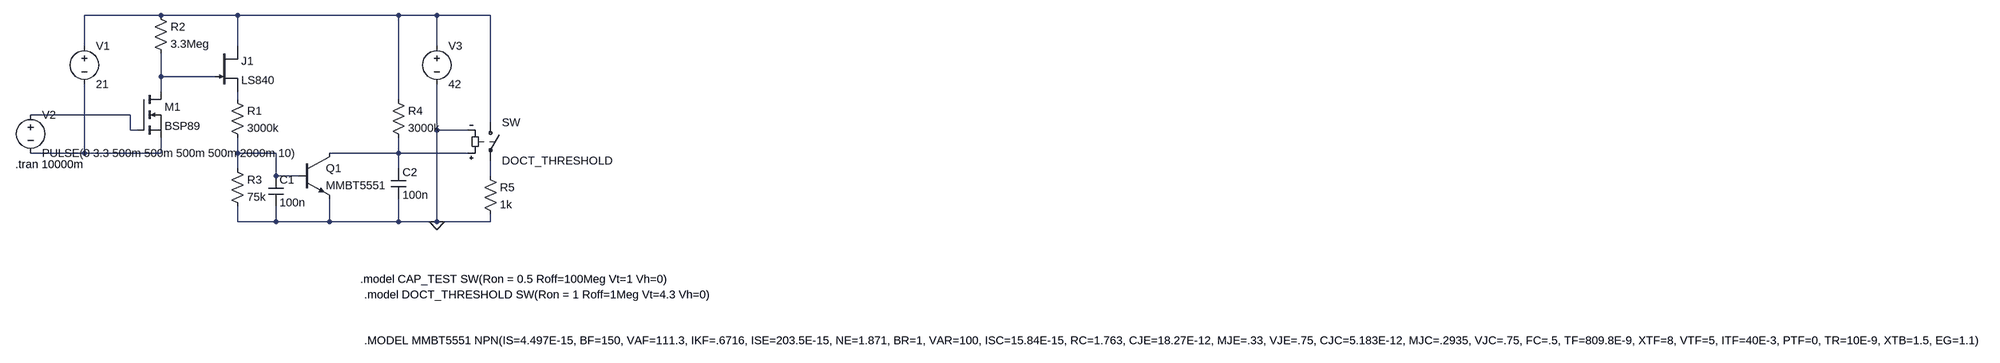
[diagram p0: schematic Reset_circuit.asc]
Reset_circuit.asc, the LTspice schematic file:
Version 4
SHEET 1 4008 2464
WIRE 16 32 -144 32
WIRE 176 32 16 32
WIRE 512 32 176 32
WIRE 592 32 512 32
WIRE 704 32 592 32
WIRE -144 96 -144 32
WIRE 176 96 176 32
WIRE 592 96 592 32
WIRE 16 160 16 112
WIRE 128 160 16 160
WIRE 16 192 16 160
WIRE 176 208 176 192
WIRE 512 208 512 32
WIRE -48 240 -256 240
WIRE 704 256 704 32
WIRE -48 272 -48 240
WIRE -32 272 -48 272
WIRE 592 272 592 176
WIRE 656 272 592 272
WIRE -144 320 -144 176
WIRE -144 320 -256 320
WIRE 16 320 16 288
WIRE 16 320 -144 320
WIRE 176 320 176 288
WIRE 256 320 176 320
WIRE 512 320 512 288
WIRE 512 320 368 320
WIRE 656 320 512 320
WIRE 176 352 176 320
WIRE 512 352 512 320
WIRE 256 368 256 320
WIRE 304 368 256 368
WIRE 704 368 704 336
WIRE 176 464 176 432
WIRE 256 464 256 432
WIRE 256 464 176 464
WIRE 368 464 368 416
WIRE 368 464 256 464
WIRE 512 464 512 416
WIRE 512 464 368 464
WIRE 592 464 592 272
WIRE 592 464 512 464
WIRE 704 464 704 448
WIRE 704 464 592 464
FLAG 592 464 0
SYMBOL njf 128 96 R0
SYMATTR InstName J1
SYMATTR Value LS840
SYMBOL voltage -144 80 R0
WINDOW 123 0 0 Left 0
WINDOW 39 0 0 Left 0
SYMATTR InstName V1
SYMATTR Value 21
SYMBOL res 160 192 R0
SYMATTR InstName R1
SYMATTR Value 3000k
SYMBOL res 0 16 R0
SYMATTR InstName R2
SYMATTR Value 3.3Meg
SYMBOL nmos -32 192 R0
SYMATTR InstName M1
SYMATTR Value BSP89
SYMBOL voltage -256 224 R0
WINDOW 123 0 0 Left 0
WINDOW 39 0 0 Left 0
SYMATTR InstName V2
SYMATTR Value PULSE(0 3.3 500m 500m 500m 500m 2000m 10)
SYMBOL voltage 592 80 R0
WINDOW 123 0 0 Left 0
WINDOW 39 0 0 Left 0
SYMATTR InstName V3
SYMATTR Value 42
SYMBOL res 160 336 R0
SYMATTR InstName R3
SYMATTR Value 75k
SYMBOL cap 240 368 R0
SYMATTR InstName C1
SYMATTR Value 100n
SYMBOL npn 304 320 R0
SYMATTR InstName Q1
SYMATTR Value MMBT5551
SYMBOL cap 496 352 R0
SYMATTR InstName C2
SYMATTR Value 100n
SYMBOL res 496 192 R0
SYMATTR InstName R4
SYMATTR Value 3000k
SYMBOL sw 704 240 R0
SYMATTR InstName SW
SYMATTR Value DOCT_THRESHOLD
SYMBOL res 688 352 R0
SYMATTR InstName R5
SYMATTR Value 1k
TEXT -288 344 Left 2 !.tran 10000m
TEXT 440 616 Left 2 !.model DOCT_THRESHOLD SW(Ron = 1 Roff=1Meg Vt=4.3 Vh=0)
TEXT 440 712 Left 2 !.MODEL MMBT5551 NPN(IS=4.497E-15, BF=150, VAF=111.3, IKF=.6716, ISE=203.5E-15, NE=1.871, BR=1, VAR=100, ISC=15.84E-15, RC=1.763, CJE=18.27E-12, MJE=.33, VJE=.75, CJC=5.183E-12, MJC=.2935, VJC=.75, FC=.5, TF=809.8E-9, XTF=8, VTF=5, ITF=40E-3, PTF=0, TR=10E-9, XTB=1.5, EG=1.1)
TEXT 432 584 Left 2 !.model CAP_TEST SW(Ron = 0.5 Roff=100Meg Vt=1 Vh=0)

The netlist it stands for:
* Reset_circuit.asc
J1 N001 N002 N003 LS840
V1 N001 N005 21
R1 N003 N006 3000k
R2 N001 N002 3.3Meg
M1 N002 N004 N005 N005 BSP89
V2 N004 N005 PULSE(0 3.3 500m 500m 500m 500m 2000m 10)
V3 N001 0 42
R3 N006 0 75k
C1 N006 0 100n
Q1 N007 N006 0 0 MMBT5551
C2 N007 0 100n
R4 N001 N007 3000k
SW N001 N008 N007 0 DOCT_THRESHOLD
R5 N008 0 1k
.model NPN NPN
.model PNP PNP
.lib standard.bjt
.model NJF NJF
.model PJF PJF
.lib standard.jft
.model NMOS NMOS
.model PMOS PMOS
.lib standard.mos
.tran 10000m
.model DOCT_THRESHOLD SW(Ron = 1 Roff=1Meg Vt=4.3 Vh=0)
.MODEL MMBT5551 NPN(IS=4.497E-15, BF=150, VAF=111.3, IKF=.6716, ISE=203.5E-15, NE=1.871, BR=1, VAR=100, ISC=15.84E-15, RC=1.763, CJE=18.27E-12, MJE=.33, VJE=.75, CJC=5.183E-12, MJC=.2935, VJC=.75, FC=.5, TF=809.8E-9, XTF=8, VTF=5, ITF=40E-3, PTF=0, TR=10E-9, XTB=1.5, EG=1.1)
.model CAP_TEST SW(Ron = 0.5 Roff=100Meg Vt=1 Vh=0)
.backanno
.end